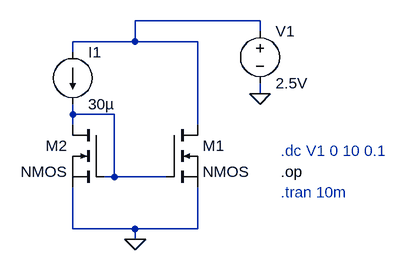
[diagram p0: schematic current_mirror simple (cs 30u).asc]
current_mirror simple (cs 30u).asc, the LTspice schematic file:
Version 4.1
SHEET 1 880 680
WIRE 304 16 112 16
WIRE 304 32 304 16
WIRE 112 48 112 16
WIRE 112 48 16 48
WIRE 208 48 112 48
WIRE 16 64 16 48
WIRE 304 128 304 112
WIRE 16 160 16 144
WIRE 80 160 16 160
WIRE 16 176 16 160
WIRE 208 176 208 48
WIRE 80 256 80 160
WIRE 80 256 64 256
WIRE 160 256 80 256
WIRE 16 336 16 272
WIRE 112 336 16 336
WIRE 208 336 208 272
WIRE 208 336 112 336
WIRE 112 352 112 336
FLAG 112 352 0
FLAG 304 128 0
SYMBOL voltage 304 16 R0
SYMATTR InstName V1
SYMATTR Value 2.5V
SYMBOL current 16 64 R0
SYMATTR InstName I1
SYMATTR Value 30µ
SYMBOL nmos 160 176 R0
SYMATTR InstName M1
SYMBOL nmos 64 176 M0
SYMATTR InstName M2
TEXT 336 216 Left 2 ;.dc V1 0 10 0.1
TEXT 336 248 Left 2 !.op
TEXT 336 280 Left 2 ;.tran 10m

The netlist it stands for:
* current_mirror simple (cs 30u).asc
V1 N001 0 2.5V
I1 N001 N002 30µ
M1 N001 N002 0 0 NMOS
M2 N002 N002 0 0 NMOS
.model NMOS NMOS
.model PMOS PMOS
.lib standard.mos
* .dc V1 0 10 0.1
.op
* .tran 10m
.backanno
.end